# EAGLE design Logic (EAGLE 9.4.1)
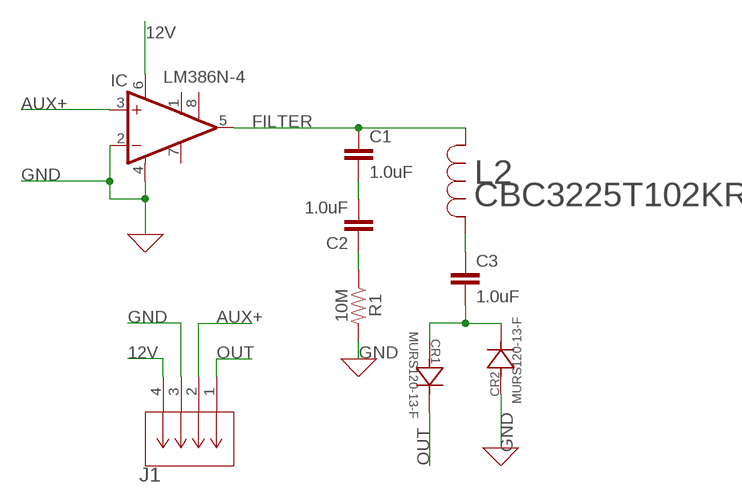
[diagram p0: schematic, sheet 1]

## Parts
C1  1.0uF  1.0UF-0603-16V-10%  [0603]
C2  1.0uF  1.0UF-0603-16V-10%  [0603]
C3  1.0uF  1.0UF-0603-16V-10%  [0603]
CR1  MURS120-13-F  [SMB]
CR2  MURS120-13-F  [SMB]
IC  LM386N-4  [DIL08]
J1  SLW-104-01-T-S  [CON4_1X4_TU_SLW]
L2  CBC3225T102KR  [IND_CBC3225T100KRV]
R1  10M  10MOHM-0603-1/10W-5%  [0603]

## Nets
12V: IC.6(VS) J1.4
AUX+: IC.3(+IN) J1.2
FILTER: C1.1 IC.5(OUT) L2.1
GND: CR2.2 IC.2(-IN) IC.4(GND) J1.3 R1.2
N$1: C2.1 R1.1
N$2: C1.2 C2.2
N$4: C3.2 CR1.2 CR2.1
OUT: CR1.1 J1.1
SPEAKER+: C3.1 L2.2
Unconnected: IC.1(GAIN) IC.7(BYPASS) IC.8(GAIN)

## Library data of the parts
C1-C3 = SparkFun-Capacitors:1.0UF: 1µF ceramic capacitors A capacitor is a passive two-terminal electrical component used to store electrical energy temporarily in an electric field.; PROD_ID: CAP-00868
CR1 CR2 = hi:MURS120-13-F; MANUFACTURER_PART_NUMBER: MURS12013F; VENDOR: Diodes Inc
IC = linear:LM386?-*: Low Voltage Audio Power Amplifier Source: http://cache.national.com/ds/LM/LM386.pdf
J1 = hi:SLW-104-01-T-S; MANUFACTURER_PART_NUMBER: SLW10401TS; VENDOR: Samtec Inc
L2 = hi:CBC3225T102KR; MANUFACTURER_PART_NUMBER: CBC3225T102KR; VENDOR: Taiyo Yuden
R1 = SparkFun-Resistors:10MOHM: RES-09327; PROD_ID: RES-08283

## Board
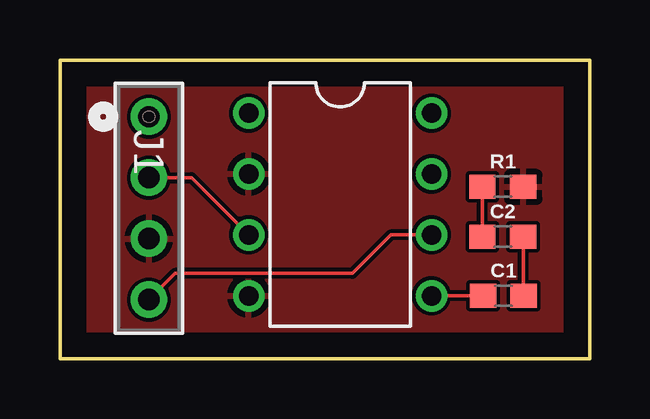
[diagram p1: board, top side]
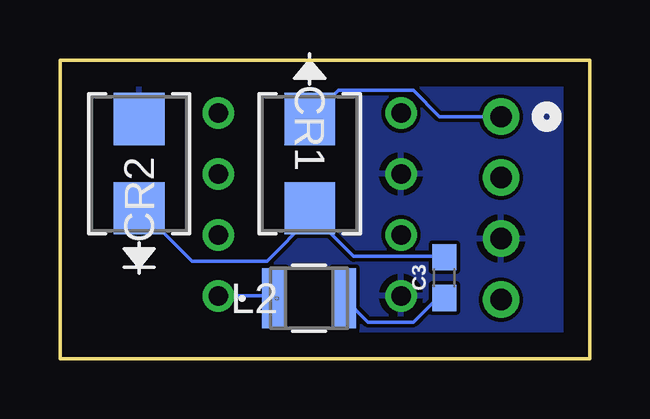
[diagram p2: board, bottom side, seen from below]

Size 22.1 x 12.45 mm. Coordinates in mm from the lower left corner, seen from the top.
Outline: 0,0 0,12.45 22.1,12.45 22.1,0 0,0
Copper layers (1*16): Top 0.035mm / dielectric 1.5mm / Bottom 0.035mm
Design rules "default": minimum track width 6mil, minimum drill 0.35mm, track to track 6mil, track to pad 6mil, pad to pad 6mil, via to via 6mil, smd to smd 6mil, copper to edge 40mil, drill to drill 6mil, minimum pad ring 10mil, minimum via ring 8mil, stop-mask expansion 4mil, vias tented up to drill 0mil, thermal gap 10mil

### Footprints (pad centres in the part's own frame; a part is rotated, then mirrored left to right if it is on the bottom)
0603 = smd 1.1 x 1: 1 -0.85,0; 2 0.85,0
SMB = smd 2.18 x 2.108: 1 -1.857,0; 2 1.857,0
DIL08 = drill 0.813 pad 1.27: 1 -3.81,-3.81; 2 -1.27,-3.81; 3 1.27,-3.81; 4 3.81,-3.81; 5 3.81,3.81; 6 1.27,3.81; 7 -1.27,3.81; 8 -3.81,3.81
CON4_1X4_TU_SLW = drill 0.889 pad 1.524: 1 -3.81,0; 2 -1.27,0; 3 1.27,0; 4 3.81,0
IND_CBC3225T100KRV = smd 0.965 x 2.489: 1 -1.473,0; 2 1.473,0

### Placement (x,y rotation side)
C1  18.49,2.62 0 top
C2  18.47,5.08 0 top
C3  6.07,3.38 90 bottom
CR1  11.68,8.13 270 bottom
CR2  18.8,8.13 90 bottom
IC  11.68,6.43 270 top
J1  3.71,6.27 270 top
L2  11.71,2.51 0 bottom
R1  18.47,7.16 0 top

### Tracks (layer width: path | path; a pad name or v marks a point on that pad's centre or on a via)
12V
  Top 0.152: IC.6 13.79,5.16 12.19,3.56 4.8,3.56 J1.4
AUX+
  Top 0.152: J1.2 5.49,7.54 IC.3
FILTER
  Top 0.152: C1.1 IC.5
  Bottom 0.152: L2.1 13.28,2.62 IC.5
GND
  pour Top: 0,12.45 22.1,12.45 22.1,0 0,0
  pour Bottom: 0,12.45 22.1,12.45 22.1,0 0,0
N$1
  Top 0.152: C2.1 R1.1
N$2
  Top 0.152: C1.2 19.32,2.64 C2.2
N$4
  Bottom 0.152: C3.2 6.11,4.27 9.86,4.27 11.68,6.1 CR1.2 11.68,5.84 13.46,4.06 16.59,4.06 CR2.1
OUT
  Bottom 0.152: J1.1 6.27,10.08 7.37,11.18 10.49,11.18 CR1.1
SPEAKER+
  Bottom 0.152: C3.1 6.36,2.53 7.37,1.52 9.25,1.52 L2.2